# EAGLE design ECAM02-EE2.0 (EAGLE 7.4.0)
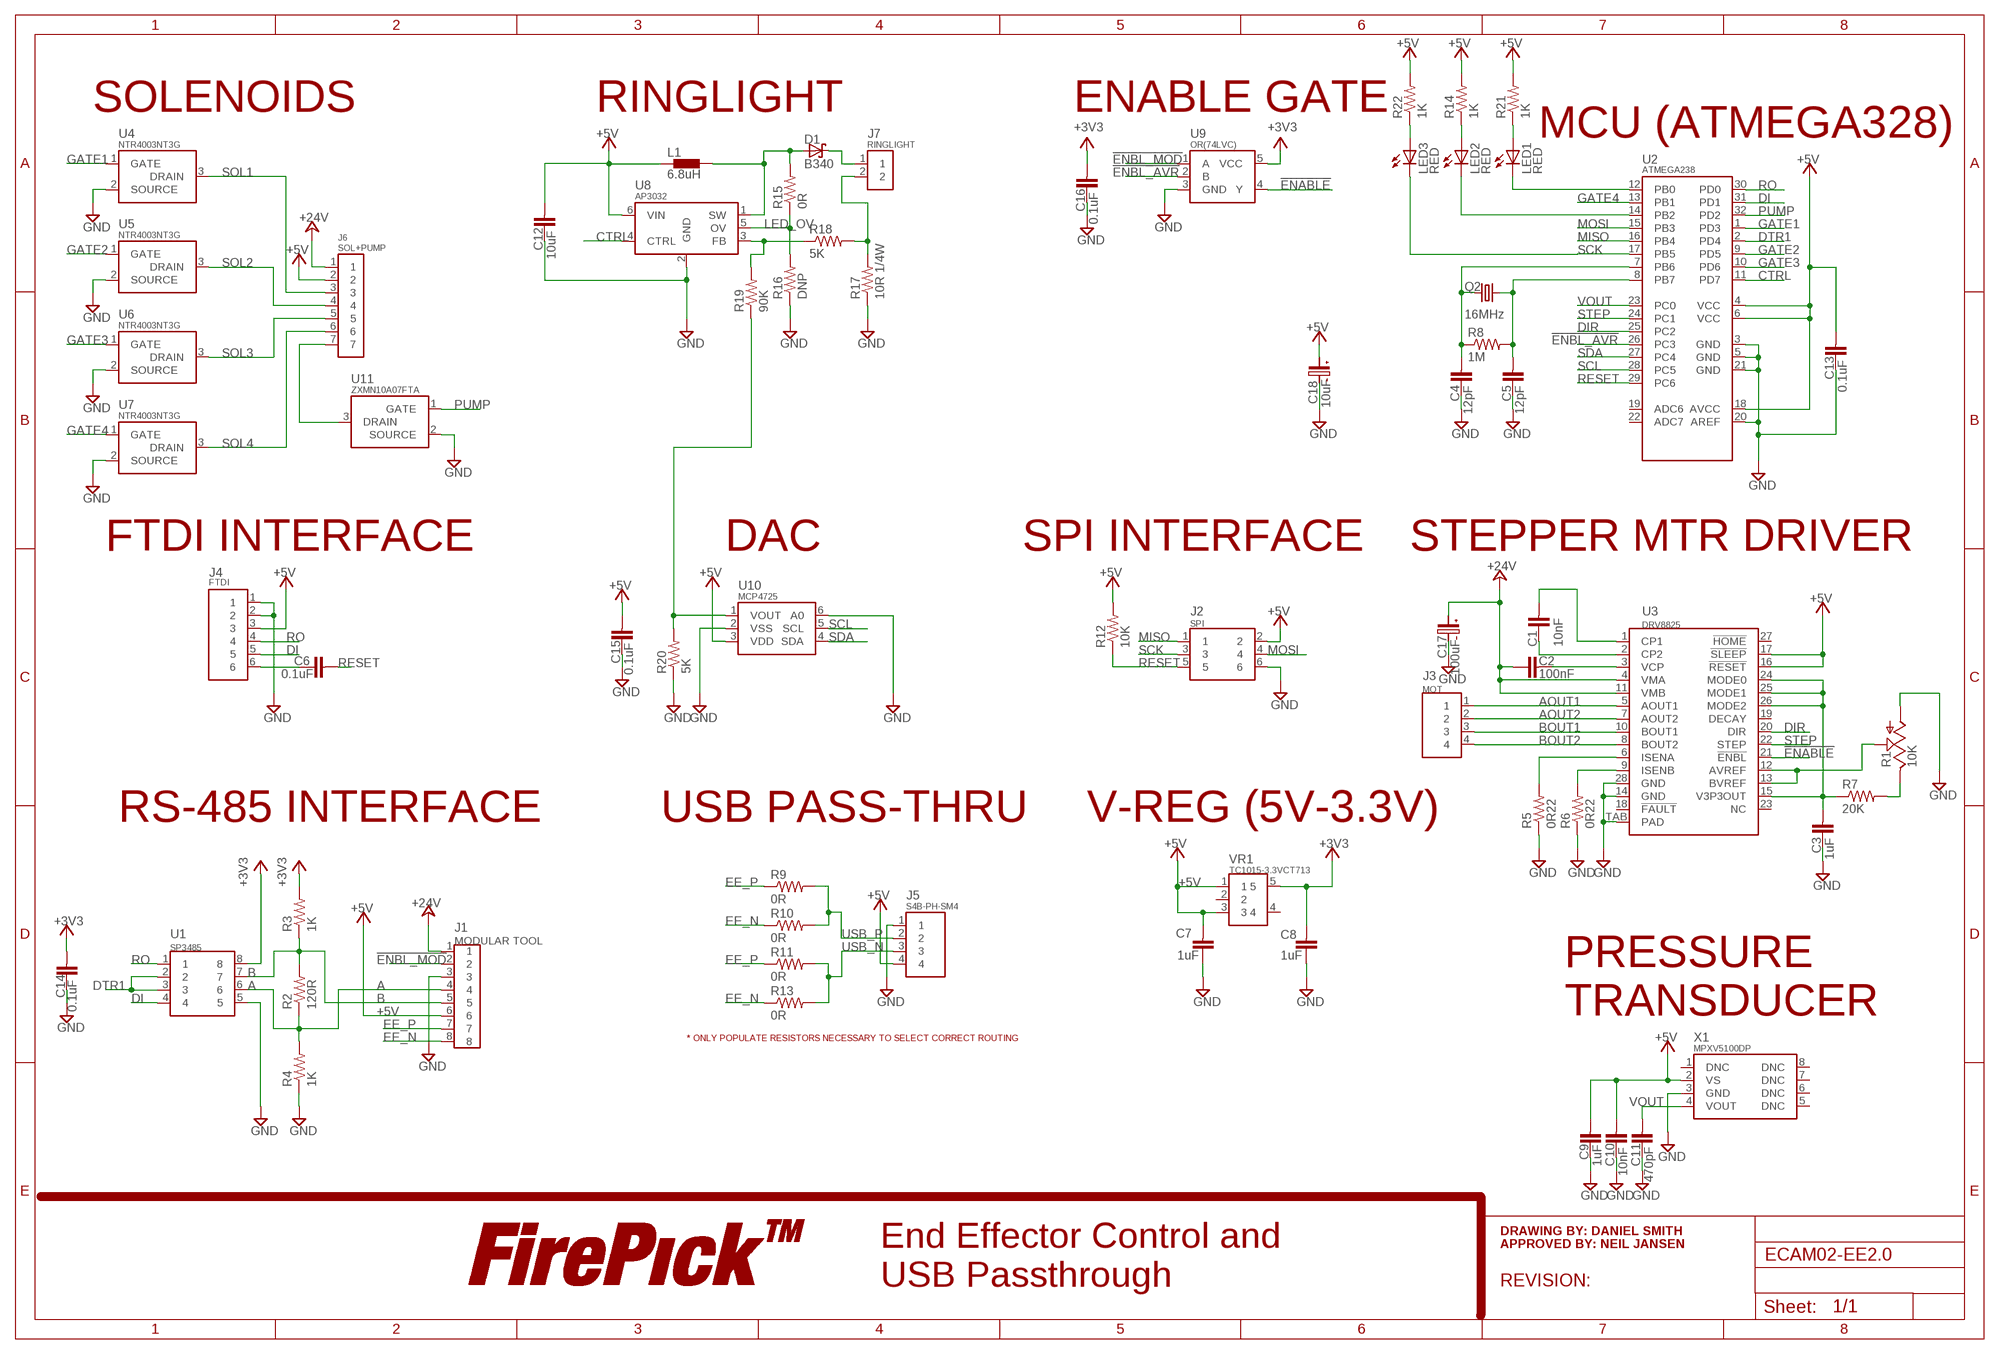
[diagram p0: schematic, sheet 1]

## Parts
C1  10nF  CPL-CAP-X7R-0603-10NF-50V  [C0603]
C2  100nF  CPL-CAP-X7R-0603-100NF-50V  [C0603]
C3  1uF  CPL-CAP-X5R-0603-1UF-50V  [C0603]
C4  12pF  CPL-CAP-C0G-0603-12PF-50V  [C0603]
C5  12pF  CPL-CAP-C0G-0603-12PF-50V  [C0603]
C6  0.1uF  CPL-CAP-X7R-0603-100NF-50V  [C0603]
C7  1uF  CPL-CAP-X5R-0603-1UF-50V  [C0603]
C8  1uF  CPL-CAP-X5R-0603-1UF-50V  [C0603]
C9  1uF  CPL-CAP-X5R-0603-1UF-50V  [C0603]
C10  10nF  CPL-CAP-X7R-0603-10NF-50V  [C0603]
C11  470pF  CPL-CAP-X7R-0603-470PF-100V  [C0603]
C12  10uF  CPL-CAP-X5R-0603-10UF-25V  [C0603]
C13  0.1uF  CPL-CAP-X7R-0603-0.1UF-35V  [C0603]
C14  0.1uF  CPL-CAP-X7R-0603-0.1UF-35V  [C0603]
C15  0.1uF  CPL-CAP-X7R-0603-0.1UF-35V  [C0603]
C16  0.1uF  CPL-CAP-X7R-0603-0.1UF-35V  [C0603]
C17  100uF  CPL-CAP-ALU-SMD-100UF-50V  [C-SMD-6.3MM]
C18  10uF  CPL-CAP-ALU-6.4MM-10UF-10V  [C-SMD-6.3MM]
D1  B340  CPL-DIO-B340-13-F-SMA  [DIO-SMA]
J1  MODULAR TOOL  CPL-CON-JST-2.0MM-8P-SMT-VRT  [CON-JST-PH-2.0MM-8P-SMT-VRT]
J2  SPI  CPL-CON-HEADER-0.1IN-2X3P-M  [CON-HDR-2X3P]
J3  MOT  CPL-CON-JST-2.0MM-4P-M-THRU-VRT  [CON-JST-PH-2.0MM-4P-THRU-VRT]
J4  FTDI  CPL-CON-HEADER-0.1IN-6P-M  [CON-HDR-6POS-MALE]
J5  S4B-PH-SM4  CPL-CON-JST-2.0MM-4P-M-SMT-VRT  [CON-JST-PH-2.0MM-4P-SMT-VRT]
J6  SOL+PUMP  CPL-CON-JST-2.0MM-7P-M-SMT-VRT  [CON-JST-PH-2.0MM-7P-SMT-VRT]
J7  RINGLIGHT  CPL-CON-JST-2.0MM-2P-M-SMT-VRT  [CON-JST-PH-2.0MM-2P-SMT-VRT]
L1  6.8uH  CPL-IND-6.8UH-250MA  [0603]
LED1  RED  CPL-LED-0603-RED  [LED0603]
LED2  RED  CPL-LED-0603-RED  [LED0603]
LED3  RED  CPL-LED-0603-RED  [LED0603]
LOGO2  LOGO-FIREPICKLARGE  [LOGO-FIREPICK]
Q2  16MHz  CPL-OSC-CRY-16MHZ-18PF  [HC-49/U-S]
R1  10K  TC33X-2  [TC33X-2]
R2  120R  CPL-RES-0603-120-0.1W  [R0603]
R3  1K  CPL-RES-0603-1K-0.1W  [R0603]
R4  1K  CPL-RES-0603-1K-0.1W  [R0603]
R5  0R22  CPL-RES-1206-0.22-0.5W  [R1206]
R6  0R22  CPL-RES-1206-0.22-0.5W  [R1206]
R7  20K  CPL-RES-0603-20K-0.1W  [R0603]
R8  1M  CPL-RES-0603-1M-0.1W  [R0603]
R9  0R  CPL-RES-0603-0-0.1W  [R0603]
R10  0R  CPL-RES-0603-0-0.1W  [R0603]
R11  0R  CPL-RES-0603-0-0.1W  [R0603]
R12  10K  CPL-RES-0603-10K-0.1W  [R0603]
R13  0R  CPL-RES-0603-0-0.1W  [R0603]
R14  1K  CPL-RES-0603-1K-0.1W  [R0603]
R15  0R  CPL-RES-0603-0-0.1W  [R0603]
R16  DNP  CPL-RES-0603-0-0.1W  [R0603]
R17  10R 1/4W  CPL-RES-1206-10-0.25W1206  [R1206]
R18  5K  CPL-RES-0603-5K-0.1W  [R0603]
R19  90K  CPL-RES-0603-90K-0.1W  [R0603]
R20  5K  CPL-RES-0603-5K-0.1W  [R0603]
R21  1K  CPL-RES-0603-1K-0.1W  [R0603]
R22  1K  CPL-RES-0603-1K-0.1W  [R0603]
U1  SP3485  [SOICN-8]
U2  ATMEGA238  CPL-MCU-ATMEL-AT328-32TQFP  [32-TQF(ATMEGA)]
U3  DRV8825  CPL-MDR-DRV8825  [28-HSSOP]
U4  NTR4003NT3G  CPL-MOSFET-NCH-SOT23NTR4003N  [SOT-23-3]
U5  NTR4003NT3G  CPL-MOSFET-NCH-SOT23NTR4003N  [SOT-23-3]
U6  NTR4003NT3G  CPL-MOSFET-NCH-SOT23NTR4003N  [SOT-23-3]
U7  NTR4003NT3G  CPL-MOSFET-NCH-SOT23NTR4003N  [SOT-23-3]
U8  AP3032  CPL-LED-DRIVER-WHT-AP3032  [SOT-23-6]
U9  OR(74LVC)  CPL-IC-LOGIC-OR-1CH-74LVC  [SOT-23-5]
U10  MCP4725  CPL-DAC-12BIT-SOT23  [SOT-23-6]
U11  ZXMN10A07FTA  CPL-MOSFET-NCH-SOT23ZXMN10A07FTA  [SOT-23-3]
VR1  TC1015-3.3VCT713  CPL-REG-LIN-3.3V-0.1A  [SOT-23-5]
X1  MPXV5100DP  CPL-SEN-PRS-MPXV5100DP  [8-SMD]

## Nets
!ENABLE: U3.21(!ENBL) U9.4(Y)
!ENBL_AVR: U2.26(PC3) U9.2(B)
!ENBL_MOD: J1.2 U9.1(A)
+3V3: C8.2 C14.2 C16.2 R3.2 U1.8 U9.5(VCC) VR1.5
+5V: C7.2 C9.2 C10.2 C12.2 C13.2 C15.2 C18.POS J1.6 J2.2 J4.3 J5.4 J6.2 L1.1 R12.2 R14.2 R21.2 R22.2 U2.4(VCC) U2.6(VCC) U2.18(AVCC) U3.16(!RESET) U3.17(!SLEEP) U8.6(VIN) U10.3(VDD) VR1.1 VR1.3 X1.2(VS)
+24V: C2.1 C17.POS J1.1 J6.1 U3.4(VMA) U3.11(VMB)
A: J1.4 R2.1 R4.2 U1.6
AOUT1: J3.1 U3.5(AOUT1)
AOUT2: J3.2 U3.7(AOUT2)
B: J1.5 R2.2 R3.1 U1.7
BOUT1: J3.3 U3.10(BOUT1)
BOUT2: J3.4 U3.8(BOUT2)
CTRL: U2.11(PD7) U8.4(CTRL)
DI: J4.5 U1.4 U2.31(PD1)
DIR: U2.25(PC2) U3.20(DIR)
DTR1: U1.2 U1.3 U2.2(PD4)
EE_N: J1.8 R10.1 R13.1
EE_P: J1.7 R9.1 R11.1
GATE1: U2.1(PD3) U4.1(GATE)
GATE2: U2.9(PD5) U5.1(GATE)
GATE3: U2.10(PD6) U6.1(GATE)
GATE4: U2.13(PB1) U7.1(GATE)
GND: C3.1 C4.1 C5.1 C7.1 C8.1 C9.1 C10.1 C11.1 C12.1 C13.1 C14.1 C15.1 C16.1 C17.NEG C18.NEG J1.3 J2.6 J4.1 J4.2 J5.1 R1.1(A) R4.1 R5.1 R6.1 R16.1 R17.1 R20.1 U1.5 U2.3(GND) U2.5(GND) U2.20(AREF) U2.21(GND) U3.14(GND) U3.28(GND) U3.TAB(PAD) U4.2(SOURCE) U5.2(SOURCE) U6.2(SOURCE) U7.2(SOURCE) U8.2(GND) U9.3(GND) U10.2(VSS) U10.6(A0) U11.2(SOURCE) X1.3(GND)
LED_ANODE: D1.NEG(C) J7.1
LED_CATHODE: J7.2 R17.2 R18.2
LED_FB: R18.1 R19.2 U8.3(FB)
LED_OV: R15.1 R16.2 U8.5(OV)
LED_SW: D1.POS(A) L1.2 R15.2 U8.1(SW)
MISO: J2.1 U2.16(PB4)
MOSI: J2.4 U2.15(PB3)
N$1: LED1.A R21.1
N$2: LED2.A R14.1
N$3: LED1.C U2.12(PB0)
N$4: LED2.C U2.14(PB2)
N$5: C1.2 U3.1(CP1)
N$6: C1.1 U3.2(CP2)
N$7: C2.2 U3.3(VCP)
N$8: R5.2 U3.6(ISENA)
N$9: R6.2 U3.9(ISENB)
N$10: R19.1 R20.2 U10.1(VOUT)
N$11: LED3.A R22.1
N$12: J6.7 U11.3(DRAIN)
N$13: C3.2 R7.1 U3.15(V3P3OUT) U3.24(MODE0) U3.25(MODE1) U3.26(MODE2)
N$14: R1.3(E) R7.2
N$15: R1.2(S) U3.12(AVREF) U3.13(BVREF)
N$16: C6.1 J4.6
PUMP: U2.32(PD2) U11.1(GATE)
RESET: C6.2 J2.5 R12.1 U2.29(PC6)
RO: J4.4 U1.1 U2.30(PD0)
SCK: J2.3 LED3.C U2.17(PB5)
SCL: U2.28(PC5) U10.5(SCL)
SDA: U2.27(PC4) U10.4(SDA)
SOL1: J6.3 U4.3(DRAIN)
SOL2: J6.4 U5.3(DRAIN)
SOL3: J6.5 U6.3(DRAIN)
SOL4: J6.6 U7.3(DRAIN)
STEP: U2.24(PC1) U3.22(STEP)
USB_N: J5.3 R11.2 R13.2
USB_P: J5.2 R9.2 R10.2
VOUT: C11.2 U2.23(PC0) X1.4(VOUT)
XTAL1: C4.2 Q2.1 R8.1 U2.7(PB6)
XTAL2: C5.2 Q2.2 R8.2 U2.8(PB7)
Unconnected: U2.19(ADC6) U2.22(ADC7) U3.18(!FAULT) U3.19(DECAY) U3.23(NC) U3.27(!HOME) VR1.2 VR1.4 X1.1(DNC) X1.5(DNC) X1.6(DNC) X1.7(DNC) X1.8(DNC)

## Notes on the sheet
- SOLENOIDS | RINGLIGHT | ENABLE GATE
- MCU (ATMEGA328)
- FTDI INTERFACE | DAC | SPI INTERFACE | STEPPER MTR DRIVER
- SPI
- RS-485 INTERFACE | USB PASS-THRU | V-REG (5V-3.3V)
- PRESSURE 
  TRANSDUCER
- * ONLY POPULATE RESISTORS NECESSARY TO SELECT CORRECT ROUTING
- DRAWING BY: DANIEL SMITH
- APPROVED BY: NEIL JANSEN
- End Effector Control and
  USB Passthrough
- REVISION:

## Library data of the parts
C1 C10 = TinWhiskers:CPL-CAP-X7R-0603-10NF-50V: Capacitor: 10nF (0.01uF), X7R, 5%; Package: 0603; Datasheet:; PARTNO: GRM188R71H103KA01D
C2 C6 = TinWhiskers:CPL-CAP-X7R-0603-100NF-50V: Capacitor: 100nF, 50V, 10%; Package: 0603; PARTNO: UMK107B7104KA-T
C3 C7-C9 = TinWhiskers:CPL-CAP-X5R-0603-1UF-50V: Capacitor: 1uF, 50V, 10%; Package: 0603; Datasheet: http://www.mouser.com/ds/2/396/mlcc_all_e-541559.pdf; PARTNO: UMK107AB7105KA-T
C4 C5 = TinWhiskers:CPL-CAP-C0G-0603-12PF-50V: Capacitor: 12pF, 50V, 5%; Package: 0603; Datasheet: http://download.siliconexpert.com/pdfs/2011/4/6/10/1/57/701/samelm_/manual/cl10c120jb8nnnc.pdf; PARTNO: GRM1885C1H120FA01J
C11 = TinWhiskers:CPL-CAP-X7R-0603-470PF-100V: Capacitor: 470pF, 100V, 5%; Package: 0603 Datasheet: http://www.mouser.com/ds/2/427/vjw1bcbascomseries-223529.pdf; PARTNO: GRM188R72A471KA01D
C12 = TinWhiskers:CPL-CAP-X5R-0603-10UF-25V: Capacitor: 10uF, 16V, 20%, X5R; Package: 0603; Datasheet: http://www.murata.com/~/media/webrenewal/support/library/catalog/products/capacitor/mlcc/c02e.ashx; PARTNO: GRM188R61C106MA73D
C13-C16 = TinWhiskers:CPL-CAP-X7R-0603-0.1UF-35V: Capacitor: 0.1uF, 35V, 10%, X7R; Package: 0603; Datasheet: http://www.yuden.co.jp/productdata/catalog/en/mlcc01_hq_e.pdf; PARTNO: GMK107BJ104KAHT
C17 = TinWhiskers:CPL-CAP-ALU-SMD-100UF-50V: Capacitor: Al-Electrolytic, 100uF, 20%, 50V, 2000hrs@105C; Package: 6.3MM Diameter (Can); Datasheet: http://industrial.panasonic.com/lecs/www-data/pdf/ABA0000/ABA0000CE135.pdf; PARTNO: EMVA500ADA101MHA0G
C18 = TinWhiskers:CPL-CAP-ALU-6.4MM-10UF-10V: Capacitor: Al-Electrolytic, 10uF, 10V 20$; Package: 6.3MM SMT (Can); Datasheet: http://www.ti.com/lit/ds/symlink/lms8117a.pdf; PARTNO: EMVH350ADA100MF60G
D1 = TinWhiskers:CPL-DIO-B340-13-F-SMA: Diode: B340-13-F (Rectifier, Shottky), Vrrm=40V, If=3A Package: SMA Datasheet: http://www.mouser.com/ds/2/115/ds30891-89887.pdf; PARTNO: B340A-13-F
J1 = TinWhiskers:CPL-CON-JST-2.0MM-8P-SMT-VRT: Connector: 2.0MM Pitch, 2-Pin; Package: SMT, Vertical; Datasheet: http://www.jst-mfg.com/product/pdf/eng/ePH.pdf; PARTNO: B8B-PH-SM4-TB(LF)(SN)
J2 = TinWhiskers:CPL-CON-HEADER-0.1IN-2X3P-M: Connector: 0.1" Pitch, 2x3P Datasheet: http://www.mouser.com/ds/2/418/NG_CD_825440_G_baseFilename-672958.pdf; PARTNO: 67996-206HLF
J3 = TinWhiskers:CPL-CON-JST-2.0MM-4P-M-THRU-VRT: Connector: 2.0MM Pitch, 4-Pin (JST: B4B-PH-K-S(LF)(SN)); Package: Thru-Hole, Vertical; Datasheet: http://www.jst-mfg.com/product/pdf/eng/ePH.pdf; PARTNO: B4B-PH-K-S(LF)(SN)
J4 = TinWhiskers:CPL-CON-HEADER-0.1IN-6P-M: Connector: Header, 0.1"-Pitch, 6-Pos, Pins (Male); PARTNO: S6B-PH-SM4-TB(LF)(SN)
J5 = TinWhiskers:CPL-CON-JST-2.0MM-4P-M-SMT-VRT: Connector: 2.0MM Pitch, 2-Pin; Package: SMT, Vertical; Datasheet: http://www.jst-mfg.com/product/pdf/eng/ePH.pdf; PARTNO: S4B-PH-SM4-TB(LF)(SN)
J6 = TinWhiskers:CPL-CON-JST-2.0MM-7P-M-SMT-VRT: Connector: 2.0MM Pitch, 7-Pin, (JST: B7B-PH-SM4-TB(LF)(SN)); Package: SMT, Vertical' Datasheet: http://www.jst-mfg.com/product/detail_e.php?series=199; PARTNO: B7B-PH-SM4-TB(LF)(SN)
J7 = TinWhiskers:CPL-CON-JST-2.0MM-2P-M-SMT-VRT: Connector: 2.0MM Pitch, 2-Pin; Package: SMT, Vertical; Datasheet: http://www.jst-mfg.com/product/pdf/eng/ePH.pdf; PARTNO: B2B-PH-SM4-TB(LF)(SN)
L1 = TinWhiskers:CPL-IND-6.8UH-250MA: Inductor: 6.8uH, 20%, 250mA; Packages: 0603; Datasheet: http://ds.yuden.co.jp/TYCOMPAS/ut/detail.do?productNo=BRL1608T6R8M&fileName=BRL1608T6R8M_SS&mode=specSheetDownload; PARTNO: BRL1608T6R8M
LED1-LED3 = TinWhiskers:CPL-LED-0603-RED: LED: Red; Package: 0603
LOGO2 = FirePick:LOGO-FIREPICK; BOM: EXCLUDE; DNP: T
Q2 = TinWhiskers:CPL-OSC-CRY-16MHZ-18PF: Crystal Oscillator: 16MHz, 18pF, 50 Ohm (ESR); Package: HC-49/US; Datasheet: http://cfm.citizen.co.jp/english/product/pdf/HCM49.pdf; PARTNO: HCM4916000000ABJT
R1 = TinWhiskers:TC33X-2: Potentiometer, Trim: 10 kOhm, 25%; Package: SMT (3-Pin); Datasheet: http://www.mouser.com/ds/2/54/TC33-75480.pdf; PARTNO: TC33X-2-103E
R2 = TinWhiskers:CPL-RES-0603-120-0.1W: Resistor: 120 Ohm, 0.1W, 1%; Package: 0603 (SMT); Datasheet:; PARTNO: RC0603FR-07120RL
R3 R4 = TinWhiskers:CPL-RES-0603-1K-0.1W: Resistor: 1 kOhm, 0.1W, 1%; Package: 0603; Datasheet: http://www.yageo.com/NewPortal/yageodocoutput?fileName=/pdf/R-Chip/PYu-RC_Group_51_RoHS_L_3.pdf; PARTNO: RC0603FR-071KL
R5 R6 = TinWhiskers:CPL-RES-1206-0.22-0.5W: Resistor: 0.22 Ohm, 0.5W, 1%, 100 ppm/C Package: 1206 Datasheet: http://www.mouser.com/ds/2/427/rcwe-244377.pdf; PARTNO: RL1206FR-7W0R22L
R7 = TinWhiskers:CPL-RES-0603-20K-0.1W: Resistor: 20 kOhms, 0.1W, 5%, X7R; Package: 0603;; PARTNO: RC0603FR-0722KL
R8 = TinWhiskers:CPL-RES-0603-1M-0.1W: Resistor: 1MOhm, 0.1W, 5%; Package: 0603; Datasheet: http://www.samsungsem.com/global/support/library/product-catalog/__icsFiles/afieldfile/2015/01/12/CHIP_RESISTOR_150112_1.pdf; PARTNO: RC0603FR-071ML
R9-R11 R13 R15 R16 = TinWhiskers:CPL-RES-0603-0-0.1W: Resistor: 0 Ohm, 0.1W, 5%; Specs: http://www.mouser.com/ds/2/315/AOA0000CE1-37422.pdf; PARTNO: RC0603JR-070RL
R12 = TinWhiskers:CPL-RES-0603-10K-0.1W: Resistor: 10kOhm, 0.1W, 1%; Package: 0603; Datasheet: http://www.mouser.com/ds/2/315/AOA0000CE2-37512.pdf; PARTNO: RC0603FR-0710KL
R14 R21 R22 = TinWhiskers:CPL-RES-0603-1K-0.1W: Resistor: 1 kOhm, 0.1W, 1%; Package: 0603; Datasheet: http://www.yageo.com/NewPortal/yageodocoutput?fileName=/pdf/R-Chip/PYu-RC_Group_51_RoHS_L_3.pdf
R17 = TinWhiskers:CPL-RES-1206-10-0.25W; PARTNO: RC1206FR-0710RL
R18 R20 = TinWhiskers:CPL-RES-0603-5K-0.1W: Resistor: 5.0 kOhm, 0.15W, 0.1%; Package: 0603; Datasheet: http://www.vishay.com/docs/60057/pnm.pdf; PARTNO: PNM0603E5001BST5
R19 = TinWhiskers:CPL-RES-0603-90K-0.1W: Resistor: 90.9 kOhm, 0.1W, 1%; Package: 0603; Datasheet: http://www.yageo.com/NewPortal/yageodocoutput?fileName=/pdf/R-Chip/PYu-RC_Group_51_RoHS_L_3.pdf; PARTNO: RC0603FR-0790K9L
U1 = TinWhiskers:SP3485: Transceiver: RS-485 Chip; Package: SOICN-8; Datasheet: http://www.exar.com/common/content/document.ashx?id=639; PARTNO: SP3485
U2 = TinWhiskers:CPL-MCU-ATMEL-AT328-32TQFP: Processor: Atmega AT328; Package: 32-TQFP; Datasheet: http://www.atmel.com/devices/atmega328.aspx; PARTNO: ATMEGA328-AUR
U3 = TinWhiskers:CPL-MDR-DRV8825: Motor Driver: DRV8825 (Texas Instrument); Package: (SMT) 28-HSSOP; Datasheet: http://www.ti.com/lit/ds/symlink/drv8825.pdf; PARTNO: DRV8825PWPR
U4-U7 = TinWhiskers:CPL-MOSFET-NCH-SOT23: MOSFET: N-Channel, Switching; Package: SOT23; Datasheet: http://www.onsemi.com/pub_link/Collateral/NTR4003N-D.PDF; PARTNO: NTR4003NT3G
U8 = TinWhiskers:CPL-LED-DRIVER-WHT-AP3032: LED Driver: White, Step-Up, AP3032 (Diodes, Inc.); Package: SOT23-6; Datasheet: http://www.diodes.com/_files/datasheets/AP3032.pdf; PARTNO: AP3032KTR-G1
U9 = TinWhiskers:CPL-IC-LOGIC-OR-1CH-74LVC: Logic Gate: OR, 1-Channel; Package: SOT23-5; Datasheet: http://www.ti.com/lit/ds/symlink/sn74lvc1g32.pdf; PARTNO: SN74LVC1G32DBVR
U10 = TinWhiskers:CPL-DAC-12BIT-SOT23: Digital-Analog Converter: 12-Bit, MPC4725; Package: SOT23-6; Datasheet: http://ww1.microchip.com/downloads/en/DeviceDoc/22039d.pdf; PARTNO: MCP4725A0T-E/CH
U11 = TinWhiskers:CPL-MOSFET-NCH-SOT23: MOSFET: N-Channel, Switching; Package: SOT23; Datasheet: http://www.onsemi.com/pub_link/Collateral/NTR4003N-D.PDF; PARTNO: ZXMN10A07FTA
VR1 = TinWhiskers:CPL-REG-LIN-3.3V-0.1A: Voltage Regulator: Linear, Vmax=6, Vout=3.3V, Io=0.1mA; Package: SOT-23-5 Datasheet: http://www.mouser.com/ds/2/268/21335b-29125.pdf; PARTNO: TC1015-3.3VCT713
X1 = TinWhiskers:CPL-SEN-PRS-MPXV5100DP: Pressure Sensor: MPXV5100DP, Temp-Calibrated, Silicon, 5V; Package: SMD-6; Datasheet: http://www.freescale.com/files/sensors/doc/data_sheet/MPX5100.pdf; PARTNO: MPXV5100DP

## Board
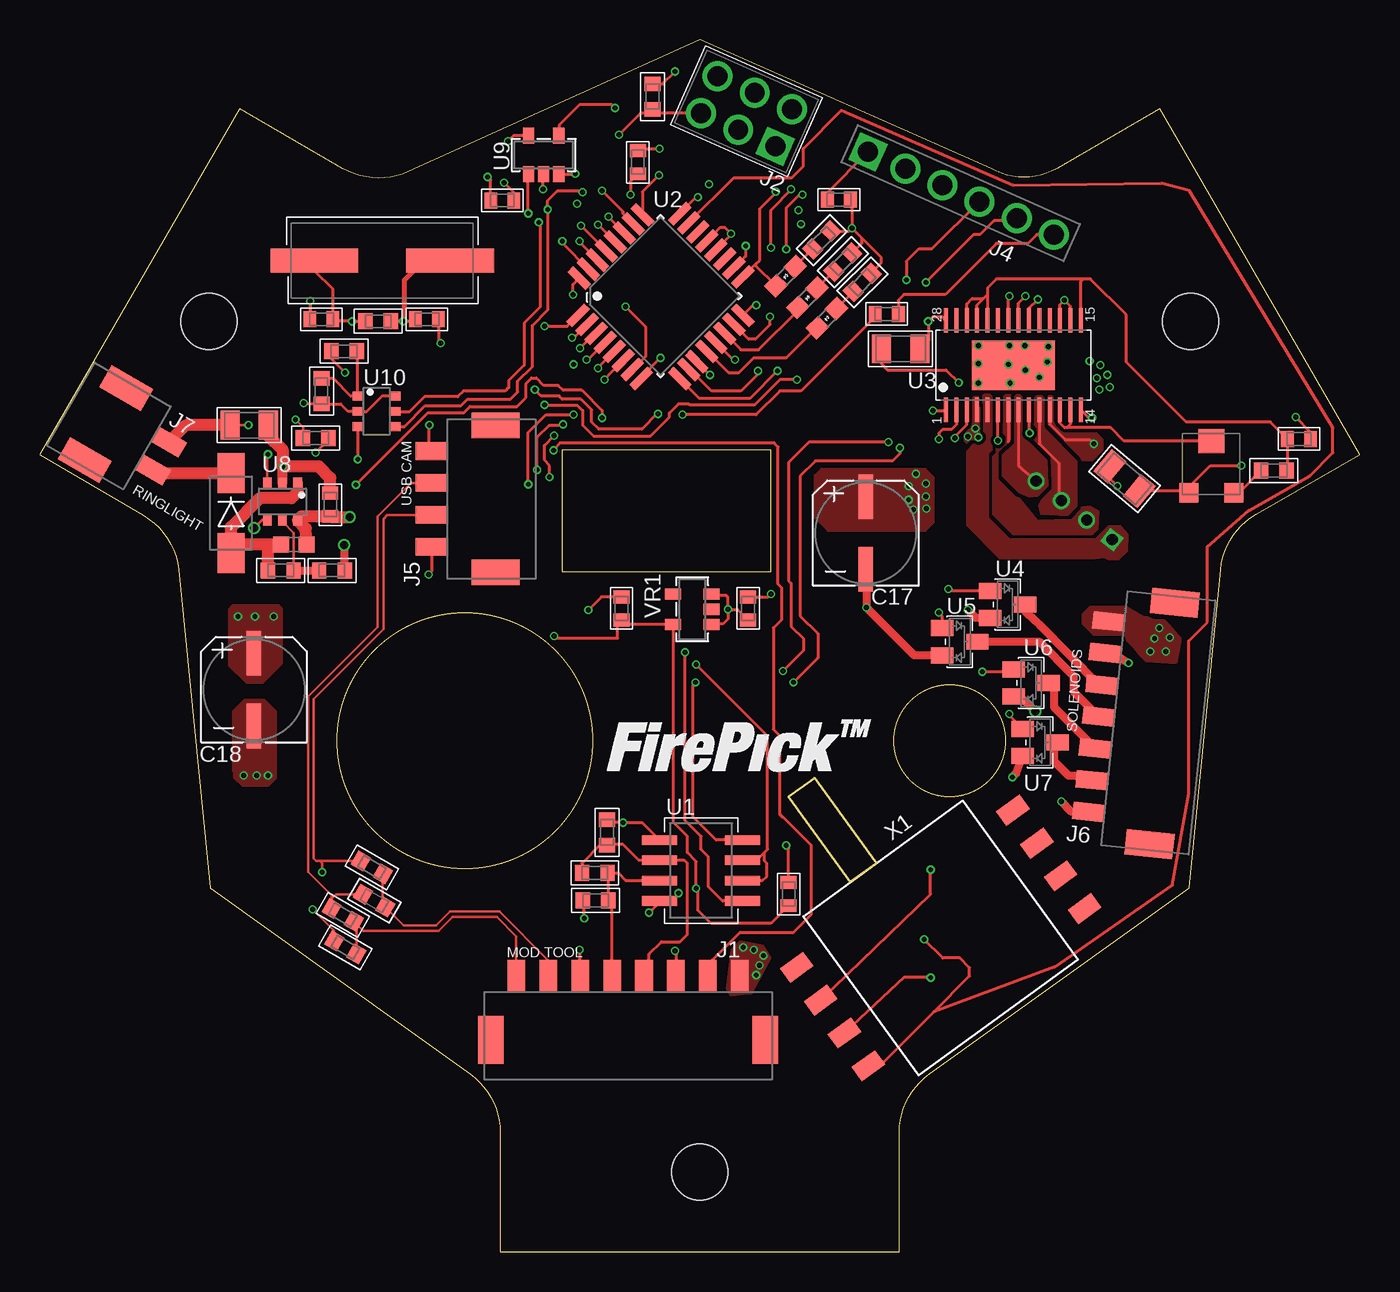
[diagram p1: board, top side]
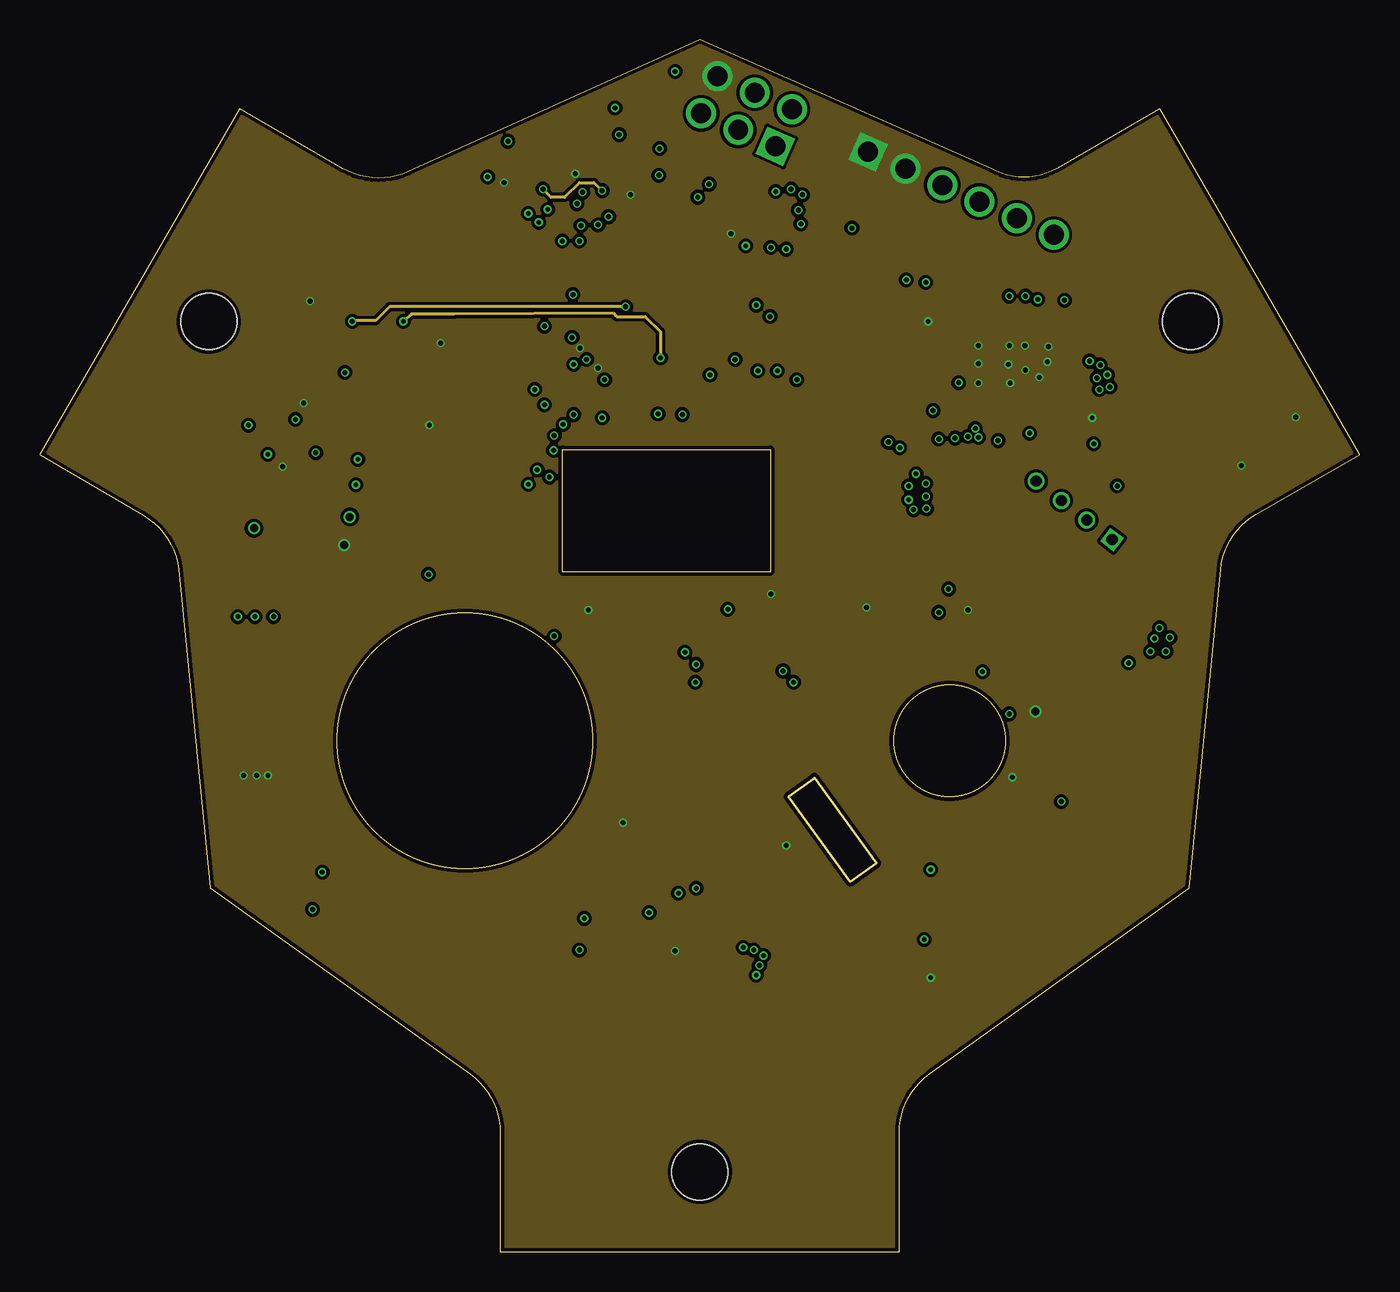
[diagram p2: board, inner layer Route2]
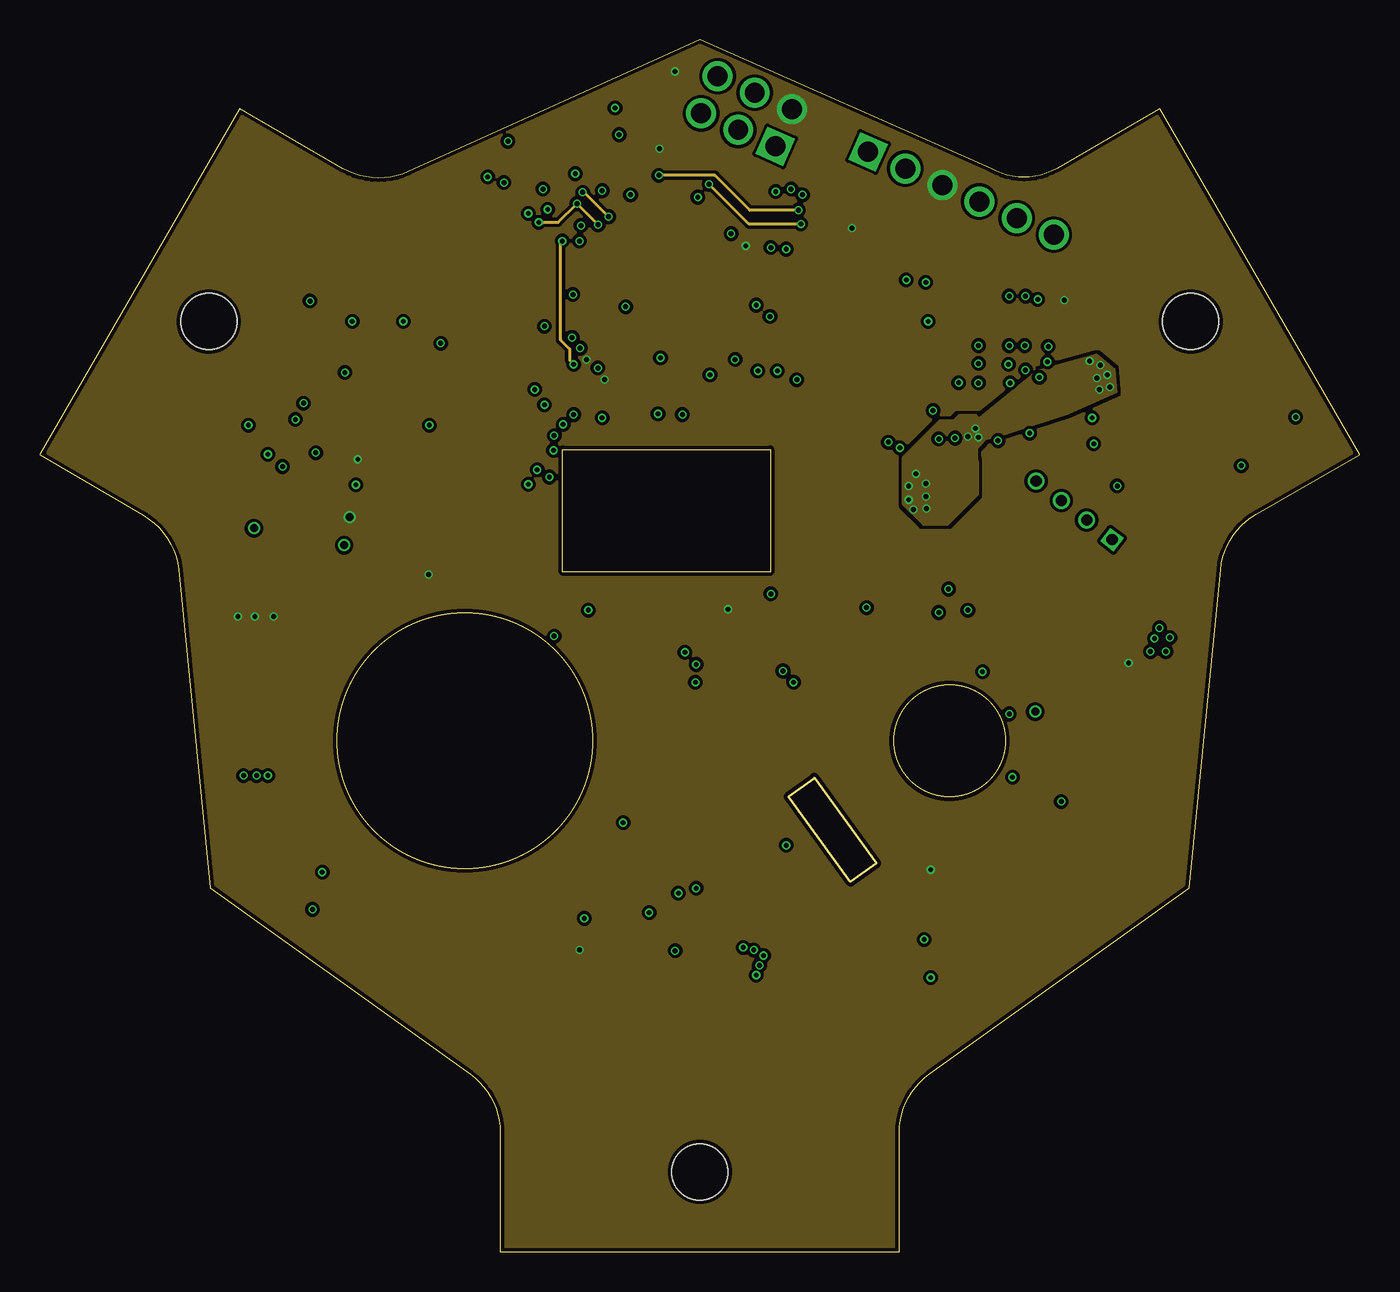
[diagram p3: board, inner layer Route15]
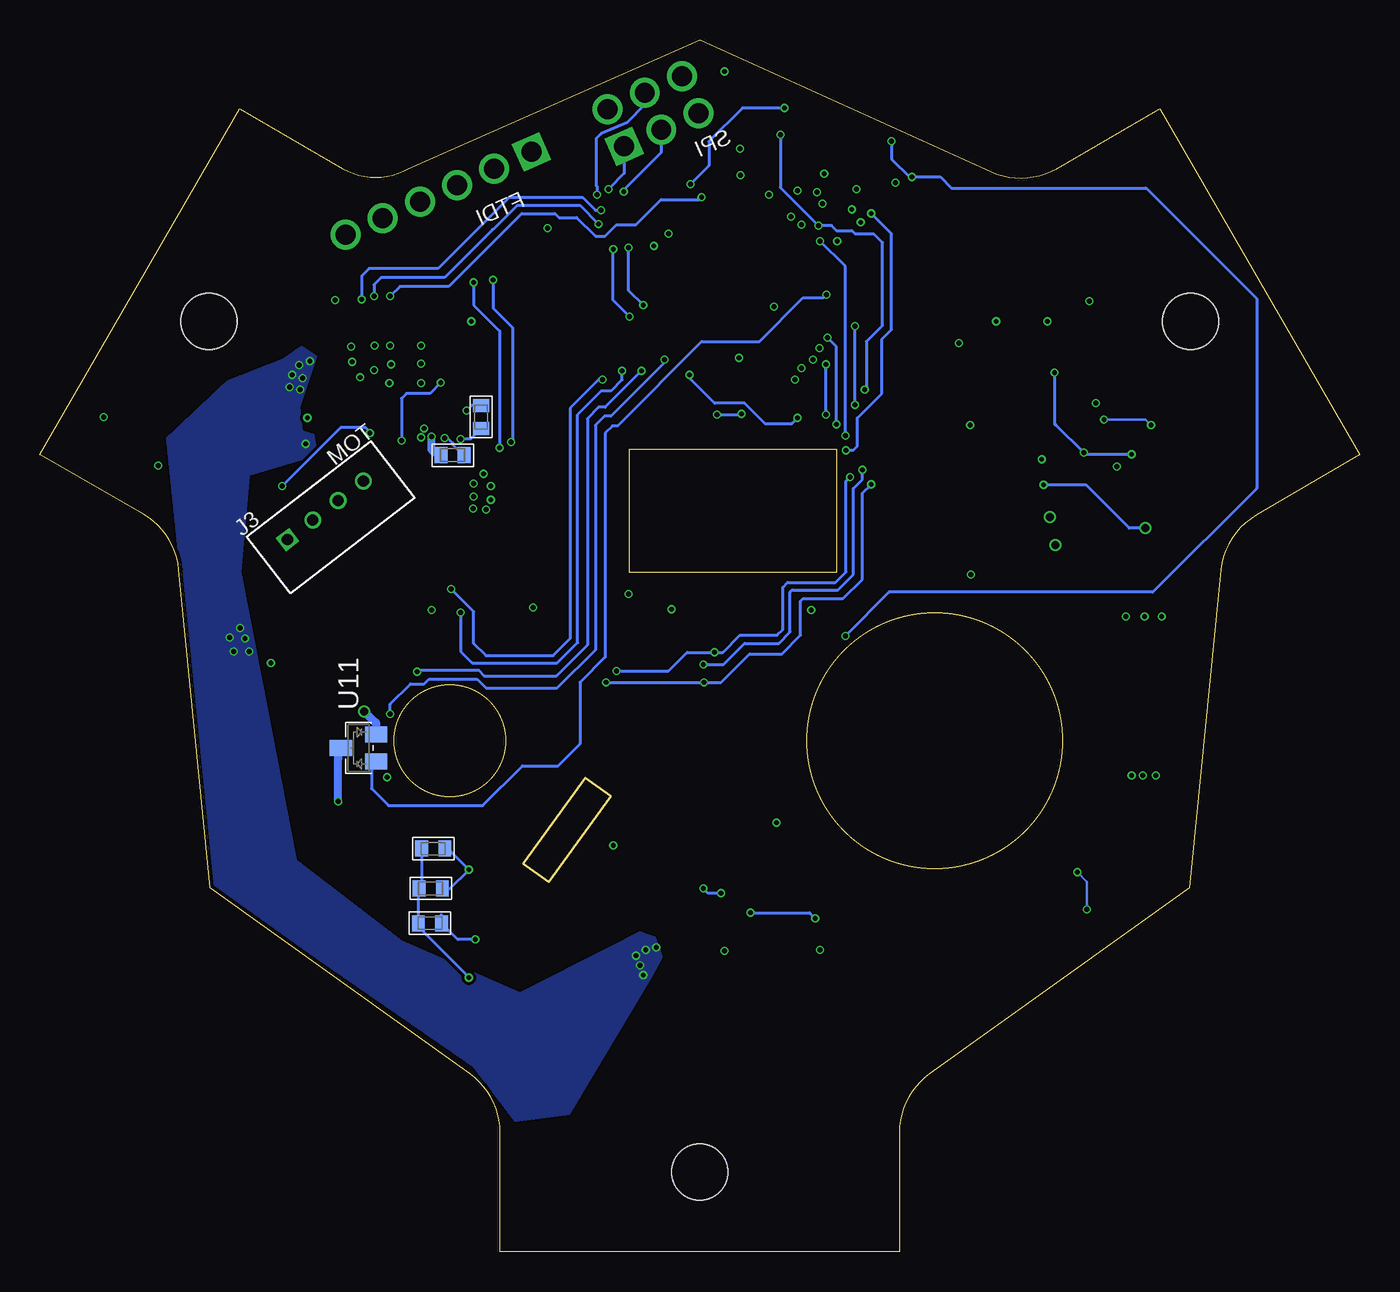
[diagram p4: board, bottom side, seen from below]

Size 82.64 x 75.89 mm. Coordinates in mm from the lower left corner, seen from the top.
Outline: 28.82,0 53.82,0 53.82,7.47 arc-54 55.7,11.13 71.97,22.8 73.94,42.73 arc-54 76.17,46.19 82.64,49.92 70.14,71.58 63.67,67.84 arc-60 59.57,67.84 41.32,75.89 23.07,67.64 arc-54 18.97,67.84 12.5,71.58 0,49.92 6.47,46.12 arc-52 8.7,42.73 10.67,22.8 26.94,11.13 arc-54 28.82,7.47 28.82,0
Outline: 32.74,42.58 32.74,50.24 45.74,50.24 45.74,42.58 32.74,42.58
Outline: circle at 56.96,32 radius 3.5
Outline: circle at 26.6,32 radius 8
Copper layers (1*2*15*16): Top 0.035mm / dielectric 0.2mm / Route2 0.0175mm / dielectric 0.3mm / Route15 0.0175mm / dielectric 0.2mm / Bottom 0.035mm
Design rules "HQPCB_4layer_DRU_no_angle": minimum track width 6mil, minimum drill 12mil, track to track 8mil, track to pad 8mil, pad to pad 6mil, via to via 8mil, smd to smd 0mil, copper to edge 10mil, drill to drill 8mil, minimum pad ring 6mil, minimum via ring 4mil, stop-mask expansion 2mil, vias tented up to drill 100mil, thermal gap 10mil
Holes 3.5 mm at 10.58,58.25 72.07,58.25 41.32,5
tRestrict: area 18.6,24 to 34.6,40; area 38.3,2 to 44.3,8; area 69.1,55.2 to 75.1,61.2; area 7.6,55.2 to 13.6,61.2
bRestrict: area 38.3,2 to 44.3,8; area 69.1,55.2 to 75.1,61.2; area 7.6,55.2 to 13.6,61.2

### Footprints (pad centres in the part's own frame; a part is rotated, then mirrored left to right if it is on the bottom)
C0603 = smd 0.8 x 1: 1 -0.725,0; 2 0.725,0
C-SMD-6.3MM = smd 0.9 x 2.8: NEG 0,-2.275; POS 0,2.275
DIO-SMA = smd 2.505 x 1.7: NEG 2.5,0; POS -2.5,0
CON-JST-PH-2.0MM-8P-SMT-VRT = smd 1.1 x 2: 1 -7,0; 2 -5,0; 3 -3,0; 4 -1,0; 5 1,0; 6 3,0; 7 5,0; 8 7,0 | smd 1.6 x 3: NC1 -8.6,4; NC2 8.6,4
CON-HDR-2X3P = drill 1.25 square: 1 -2.54,1.27 | drill 1.25: 2 -2.54,-1.27; 3 0,1.27; 4 0,-1.27; 5 2.54,1.27; 6 2.54,-1.27
CON-JST-PH-2.0MM-4P-THRU-VRT = drill 0.7 square: 1 -3,0 | drill 0.7: 2 -1,0; 3 1,0; 4 3,0
CON-HDR-6POS-MALE = drill 1.25 square: 1 -6.35,0 | drill 1.25: 2 -3.8,0; 3 -1.26,0; 4 1.28,0; 5 3.85,0; 6 6.39,0
CON-JST-PH-2.0MM-4P-SMT-VRT = smd 1.1 x 2: 1 -3,0; 2 -1,0; 3 1,0; 4 3,0 | smd 1.6 x 3: NC1 -4.6,4; NC2 4.6,4
CON-JST-PH-2.0MM-7P-SMT-VRT = smd 1.1 x 2: 1 -6,0.1; 2 -4,0.1; 3 -2,0.1; 4 0,0.1; 5 2,0.1; 6 4,0.1; 7 6,0.1 | smd 1.6 x 3: NC1 -7.6,4.1; NC2 7.6,4.1
CON-JST-PH-2.0MM-2P-SMT-VRT = smd 1.1 x 2: 1 -1,0; 2 1,0 | smd 1.6 x 3: NC1 -2.6,4; NC2 2.6,4
0603 = smd 1 x 1: 1 -0.8,0; 2 0.8,0
LED0603 = smd 1.1 x 1: A -0.85,0; C 0.85,0
HC-49/U-S = smd 5.5 x 1.5: 1 -4.25,0; 2 4.25,0
TC33X-2 = smd 1.2 x 1.2: 1 -1.4,-1.8; 3 1.4,-1.8 | smd 1.6 x 1.5: 2 0,1.45
R0603 = smd 0.9 x 1: 1 -0.8,0; 2 0.8,0
R1206 = smd 1.2 x 1.8: 1 -1.2,0; 2 1.2,0
SOICN-8 = smd 2.2 x 0.6: 1 -2.6,1.905; 2 -2.6,0.635; 3 -2.6,-0.635; 4 -2.6,-1.905; 5 2.6,-1.905; 6 2.6,-0.635; 7 2.6,0.635; 8 2.6,1.905
32-TQF(ATMEGA) = smd 1.6 x 0.5: 1 -4.5,2.8; 2 -4.5,2; 3 -4.5,1.2; 4 -4.5,0.4; 5 -4.5,-0.4; 6 -4.5,-1.2; 7 -4.5,-2; 8 -4.5,-2.8; 17 4.5,-2.8; 18 4.5,-2; 19 4.5,-1.2; 20 4.5,-0.4; 21 4.5,0.4; 22 4.5,1.2; 23 4.5,2; 24 4.5,2.8 | smd 0.5 x 1.6: 9 -2.8,-4.5; 10 -2,-4.5; 11 -1.3,-4.5; 12 -0.4,-4.5; 13 0.4,-4.5; 14 1.2,-4.5; 15 2,-4.5; 16 2.8,-4.5; 25 2.8,4.4; 26 2,4.4; 27 1.2,4.4; 28 0.4,4.4; 29 -0.4,4.4; 30 -1.2,4.4; 31 -2,4.4; 32 -2.8,4.4
28-HSSOP = smd 1.55 x 0.25: 1 -2.8,4.225; 2 -2.8,3.575; 3 -2.8,2.925; 4 -2.8,2.275; 5 -2.8,1.625; 6 -2.8,0.975; 7 -2.8,0.325; 8 -2.8,-0.325; 9 -2.8,-0.975; 10 -2.8,-1.625; 11 -2.8,-2.275; 12 -2.8,-2.925; 13 -2.8,-3.575; 14 -2.8,-4.225; 15 2.8,-4.225; 16 2.8,-3.575; 17 2.8,-2.925; 18 2.8,-2.275; 19 2.8,-1.625; 20 2.8,-0.975; 21 2.8,-0.325; 22 2.8,0.325; 23 2.8,0.975; 24 2.8,1.625; 25 2.8,2.275; 26 2.8,2.925; 27 2.8,3.575; 28 2.8,4.225 | smd 3.1 x 5.18: TAB 0,0
SOT-23-3 = smd 1 x 1.4: 1 -0.85,-1.1; 2 0.85,-1.1; 3 0,1.1
SOT-23-6 = smd 0.55 x 0.65: 1 0.95,1.175; 2 0,1.175; 3 -0.95,1.175; 4 -0.95,-1.175; 5 0,-1.175; 6 0.95,-1.175
SOT-23-5 = smd 0.7 x 1: 1 0.95,1.2; 2 0,1.2; 3 -0.95,1.2; 4 -0.95,-1.2; 5 0.95,-1.2
8-SMD = smd 1.8 x 1.115: 1 -8.367,3.81; 2 -8.367,1.27; 3 -8.367,-1.27; 4 -8.367,-3.81; 5 8.367,-3.81; 6 8.367,-1.27; 7 8.367,1.27; 8 8.367,3.81

### Placement (x,y rotation side)
C1  55.02,52.27 90 bottom
C2  56.79,49.89 0 bottom
C3  78.84,50.9 180 top
C4  17.63,58.39 0 top
C5  24.23,58.39 180 top
C6  53.04,58.72 180 top
C7  44.35,40.28 270 top
C8  36.42,40.28 270 top
C9  58.01,25.25 0 bottom
C10  58.17,22.76 0 bottom
C11  58.22,20.57 0 bottom
C12  18.19,46.79 270 top
C13  50.04,65.89 0 top
C14  46.89,22.4 270 top
C15  37.44,68.22 90 top
C16  28.96,65.84 180 top
C17  51.71,45.01 0 top
C18  13.41,35.2 0 top
D1  11.97,46.25 90 top
J1  36.83,17.27 180 top
J2  44.25,71.42 156 top
J3  64.76,46.43 37.6 bottom
J4  57.66,66.29 336 top
J5  24.53,47.14 270 top
J6  66.2,33.52 264 top
J7  7.57,49.83 60 top
L1  15.9,44.3 180 top
LED1  49.28,58.46 225 top
LED2  48.06,59.75 225 top
LED3  46.7,61.09 225 top
LOGO2  35.31,28.35 0 top
Q2  21.44,62.08 0 top
R1  73.36,49.33 0 top
R2  34.75,23.72 0 top
R3  34.8,22 180 top
R4  35.51,26.26 270 top
R5  53.9,56.54 180 top
R6  67.92,48.41 140 top
R7  77.27,48.92 180 top
R8  21.18,58.27 0 top
R9  20.93,21.99 150 top
R10  18.96,21.09 150 top
R11  20.78,24.07 150 top
R12  38.35,72.34 90 top
R13  19.13,19.06 150 top
R14  50.29,61.97 45 top
R15  15.09,42.67 180 top
R16  18.29,42.67 180 top
R17  13.11,51.77 180 top
R18  17.27,50.95 180 top
R19  19.05,56.39 180 top
R20  17.63,53.9 90 top
R21  51.5,60.71 45 top
R22  48.96,63.36 45 top
U1  41.4,23.88 180 top
U2  38.86,59.84 45 top
U3  60.96,55.52 90 top
U4  60.6,40.54 270 top
U5  57.61,38.2 270 top
U6  62.08,35.61 270 top
U7  62.64,31.9 270 top
U8  15.19,46.99 0 top
U9  31.55,68.68 180 top
U10  21.08,52.63 90 top
U11  62.69,31.55 90 bottom
VR1  40.84,40.23 270 top
X1  56.41,19.65 36 top

### Tracks (layer width: path | path; a pad name or v marks a point on that pad's centre or on a via)
!ENABLE  (via drill 0.3)
  Top 0.203: U3.21 61.28,59.41 v61.72,59.84 | U9.4 32.51,69.9 32.51,70.56 33.78,71.83 35.81,71.83 v36.02,71.63
  Route15 0.203: v47.65,64.36 44.4,64.36 v41.91,66.85
  Bottom 0.203: v47.65,64.36 48.82,65.53 52.73,65.53 54.25,64.01 54.3,64.01 57.3,61.01 61.27,61.01 61.72,60.55 v61.72,59.84 | v36.02,71.63 38.66,71.63 40.74,69.55 40.74,68.02 v41.91,66.85
!ENBL_AVR  (via drill 0.3)
  Top 0.203: 37.16,64.38 U2.26 36.52,65.02 36.52,65.13 v35.2,66.45 | v31.5,66.55 31.5,67.43 U9.2
  Route2 0.203: v31.5,66.55 32,66.04 32.87,66.04 33.78,66.95 34.7,66.95 v35.2,66.45
!ENBL_MOD  (via drill 0.3)
  Top 0.203: J1.2 41.83,18 43.84,20.02 47.19,20.02 48.31,21.13 48.31,25.45 46.53,27.23 46.48,27.23 46.33,27.38 46.33,32.31 45.92,32.72 45.92,39.06 46.43,39.57 46.43,41.6 46.23,41.81 46.23,50.39 45.97,50.65 32.56,50.65 v32.16,50.19 | v30.58,65.02 30.58,67.47 U9.1
  Bottom 0.203: v32.16,50.19 31.7,50.19 31.45,50.44 31.45,52.22 29.92,53.75 29.92,57.15 29.31,57.76 29.31,63.75 v30.58,65.02
+3V3  (via drill 0.3)
  Top 0.203: v38.15,21.23 38.8,21.89 U1.8 39.5,21.97 v39.98,22.45 | v34.09,20.88 34.09,21.91 R3.2 | U9.5 29.65,69.88 v29.31,69.55 | v32.21,38.56 32.36,38.41 36.18,38.41 36.18,39.32 C8.2 36.7,39.28 VR1.5 39.67,39.25 39.67,26.87 40.54,26.01 40.54,24.99 41.1,24.43 v41.1,22.76 41.2,22.66 41.2,21.39 42.01,20.57 45.78,20.57 C14.2 | C16.2 28.23,67.12 v28.04,67.31
  Bottom 0.203: v38.15,21.23 34.44,21.23 v34.09,20.88 | v39.98,22.45 40.79,22.45 v41.1,22.76 | v29.31,69.55 29.31,68.43 28.19,67.31 v28.04,67.31 26.26,67.31 25.55,66.6 13.41,66.6 13.39,66.62 6.45,59.69 6.45,47.8 12.95,41.3 29.46,41.3 v32.21,38.56
+5V  (via drill 0.3, 0.5)
  Top 0.203: v33.78,18.9 33.78,17.32 J1.6 | U3.16 64.53,59.21 v64.16,59.59 63.88,59.31 U3.17 | v43.08,40.23 43.67,40.23 C7.2 | v43.08,40.23 43.08,39.62 42.77,39.32 42.08,39.32 VR1.1 | v43.08,40.23 43.08,41 42.98,41.1 42.13,41.1 VR1.3 | R12.2 39,73.14 v39.78,73.91 | v44.2,62.99 44.2,62.35 U2.18 | U2.6 35.36,54.64 v35.36,54.61 | U2.4 34.33,55.88 v34.24,55.88 | X1.2 55.78,22.39 v55.78,23.93 | J5.4 24.53,42.61 v24.33,42.42 | C15.2 37.58,69.09 v38.81,69.09 | C13.2 50.85,65.34 v50.85,64.11 | U10.3 v19.91,49.62 | v50.85,64.11 51.49,63.48 | 51.49,63.48 52.68,62.28 52.68,61.92 52.07,61.31 R21.2 | R14.2 51.49,63.17 51.49,63.48 | R22.2 50.66,63.92 v50.85,64.11
  Top 0.5: J6.2 67.38,37.39 v68.17,36.88 | C12.2 18.27,46.02
  Top 0.762: 18.27,46.02 v19.41,46.02 | C12.2 16.39,46.06 U8.6 16.65,45.3 L1.1
  Bottom 0.203: C10.2 56.95,22.76 v55.78,23.93 57.1,25.25 C9.2
  other vias: 12.4,39.78 13.46,39.78 14.63,39.78
  pour Route15 (rank 2, no thermals): -0.05,49.94 12.5,71.58 41.3,75.95 70.15,71.58 82.65,49.94 71.93,22.76 53.85,-0.05 28.85,0 10.67,22.76
  pour Top (no thermals): 11.79,40.18 11.79,36.73 12.9,35.61 13.97,35.61 15.19,36.83 15.19,40.28 14.99,40.49 12.04,40.49 11.79,40.23
+24V  (via drill 0.3)
  Top 0.203: J1.1 43.83,17.72 | 58.67,52.71 U3.4 | U3.11 63.23,51.83 64.21,50.85 65.73,50.85 v65.99,50.6
  Bottom 0.508: 57.52,50.05 57.93,50.05 58.12,50.24 v58.12,51.05
  Bottom 0.61: C2.1 57.52,50.05
  other vias: 44.7,18.9 66.4,55.52 44.04,19.05 45.06,17.93 66.19,54.71 65.74,55.78 70.1,39.07 69.8,38.4 69.55,37.59 54.86,48.72 55.47,48.11 54.41,47.96 70.76,38.46 70.51,37.59 66.85,54.91 67.01,54.15 66.34,54 44.86,17.32 45.31,18.54 58.78,51 58.57,51.56 54.41,47.09 55.47,47.29 55.52,46.53 54.71,46.48
  pour Route15 (no thermals): 57.71,51.1 58.01,50.6 59.84,50.95 64.36,52.43 67.46,53.8 67.36,55.27 66.19,56.24 62.43,55.22 58.32,51.87
  pour Bottom (no thermals): 66.24,56.74 65.28,56.08 66.34,52.88 66.19,51.41 65.48,51.21 65.28,50.14 66.04,49.63 69.49,48.62 70.05,42.57 68.28,33.53 66.55,24.54 59.99,19.51 52.58,16.26 45.06,20.07 44.09,19.71 43.64,18.44 44.3,17.22 49.48,8.59 52.88,8.13 55.52,11.58 71.83,22.86 74.73,50.95 70.92,54.56 67.41,55.93
  pour Top (no thermals): 43.84,19.51 45.31,19.2 45.82,18.39 44.6,16.15 43.23,16 42.98,16.46 43.28,18.95
  pour Top (rank 3, no thermals): 62.99,52.68 63.09,53.54 63.2,53.64 63.35,53.64 63.45,53.54 63.45,52.02 64.01,51.46 66.04,51.46 66.6,50.9 66.6,50.19 65.89,49.48 65.28,49.53 63.04,51.61 63.04,52.63
  pour Top (no thermals): 69.09,39.73 69.34,39.73 69.8,39.52 70.41,39.52 70.66,39.27 71.42,38.4 71.12,36.88 69.29,36.98 68.88,37.39 68.53,37.85 68.17,38.2 68.07,38.51 67.92,38.66 65.99,38.66 65.33,39.32 65.33,39.93 65.79,40.39 67.97,40.39
  pour Route15: 58.67,49.53 58.67,50.34 59.44,51.1 59.44,51.56 58.62,52.37 57.56,52.37 57.2,52.02 56.34,52.02 54.05,49.73 54.05,46.84 55.32,45.57 56.85,45.57 58.72,47.45 58.72,49.48
  pour Top (no thermals): 53.14,49.02 55.42,49.02 55.93,48.51 55.93,45.67 55.42,45.16 49.38,45.16 48.56,45.97 48.56,48.62 48.97,49.02
  pour Top (rank 2, no thermals): 58.98,53.54 58.47,53.54 58.42,53.49 58.37,53.44 58.37,51.92 58.27,51.82 57.86,51.41 57.86,50.8 58.01,50.65 58.83,50.65 59.03,50.85 59.03,53.49
A
  Top 0.203: J1.4 38.15,17.59 38.15,18.64 38.91,19.41 40.08,19.41 40.54,19.86 40.54,24.33 40.36,24.51 U1.6 37.52,24.51 36.52,25.5 35.55,25.5 R4.2 35.06,25.46 33.93,24.33 33.93,23.74 R2.1
AOUT1
  pour Top (no thermals): 59.03,53.14 59.03,53.64 59.13,53.75 59.49,53.75 59.64,53.59 59.64,50.19 59.44,49.99 59.44,45.97 60.76,44.65 66.09,44.65 66.9,45.47 67.67,45.52 68.17,44.96 68.12,43.84 67.56,43.33 66.9,43.33 66.65,43.43 66.09,43.38 60.1,43.38 58.01,45.47 58.01,50.14 58.47,50.6 58.67,50.6 59.08,51 59.08,53.09
AOUT2
  Top 0.203: U3.7 60.63,50.73
  pour Top (rank 3, no thermals): 60.3,53.19 60.3,53.54 60.45,53.7 60.81,53.7 60.91,53.59 60.91,50.55 60.25,49.89 60.25,48.56 62.48,45.82 64.47,45.87 65.07,46.63 65.74,46.74 66.34,46.38 66.29,45.26 65.89,44.86 60.76,44.7 59.44,46.02 59.44,49.99 59.84,50.39 60.2,50.39 60.5,50.7 60.5,51.05 60.2,51.36 60.2,53.09
B
  Top 0.203: J1.5 35.83,21.76 R3.1 35.6,23.67 R2.2 36.22,23.72 36.68,23.27 38.78,23.27 U1.7
BOUT1
  Top 0.203: U3.10 62.59,50.6 63.8,49.38 63.8,47.27 J3.3
  pour Top (rank 2, no thermals): 62.28,52.17 62.28,53.49 62.43,53.64 62.74,53.64 62.89,53.49 62.89,51.61 64.97,49.53 64.97,46.69 64.36,46.08 62.64,46.18 62.53,46.74 62.74,47.19 63.04,47.55 63.3,48.41 63.3,49.48 62.23,50.55 62.23,50.85 62.43,51.05 62.43,51.56 62.23,51.77 62.23,52.12
BOUT2
  Top 0.203: U3.8 61.28,49.21 J3.4
  pour Top (no thermals): 61.01,50.65 61.01,53.54 61.16,53.7 61.37,53.7 61.52,53.54 61.52,51.1 61.93,50.7 61.98,50.7 63.09,49.58 63.14,47.96 62.48,47.29 61.98,47.24 61.32,47.5 60.25,48.56 60.25,49.89
CTRL  (via drill 0.3, 0.5)
  Top 0.203: U2.11 41.13,55.74 v41.96,54.91 | U8.4 13.91,45.81 v13.41,45.31 | v19.79,48.03 24.28,52.53 26.52,52.53 26.92,52.93 29.87,52.93 30.43,53.49 30.43,54.36 30.79,54.71 31.09,54.71 31.55,54.25 32.46,54.25 32.77,53.95 33.93,53.95 35.2,52.68 v35.2,52.22
  Bottom 0.203: v41.96,54.91 41.96,54.71 40.39,53.14 38.51,53.14 37.24,51.87 35.56,51.87 v35.2,52.22 | v13.41,45.31 14.43,45.31 17.14,48.03 v19.79,48.03
DI  (via drill 0.3)
  Top 0.203: U1.4 42.34,25.78 40.89,27.23 40.89,35.51 v41.05,35.66 | v30.58,48.06 30.58,51.31 31.7,52.43 v33.43,52.43 | v32.72,63.3 32.72,63.16 U2.31 | v53.85,50.34 53.85,49.99 53.39,49.53 48.56,49.53 47.6,48.56 47.6,39.83 48.72,38.71 48.72,37.19 v47.19,35.66 | J4.5 61.01,64.57 59.74,64.57 58.88,63.7 58.47,63.7 v55.47,60.71
  Route15 0.203: v32.72,63.3 32.61,63.2 32.61,57.1 33.17,56.54 33.17,55.83 v33.43,55.58
  Bottom 0.203: v30.58,48.06 31.14,47.5 31.14,42.11 32.36,40.89 34.85,40.89 35,40.74 35,38.61 36.17,37.44 38.2,37.44 39.98,35.66 v41.05,35.66 v47.19,35.66 | v33.43,52.43 v33.43,55.58 | v55.47,60.71 55.47,59.28 53.85,57.66 v53.85,50.34
DIR  (via drill 0.3)
  Top 0.203: U3.20 61.94,59.09 v62.48,59.64 | v38.76,67.41 37.73,66.38 U2.25
  Route15 0.203: v47.5,65.23 44.45,65.23 42.27,67.41 v38.76,67.41
  Bottom 0.203: v47.5,65.23 47.85,65.23 48.67,66.04 53.24,66.04 57.71,61.57 62.03,61.57 62.48,61.11 v62.48,59.64
DTR1  (via drill 0.3)
  Top 0.203: U1.2 45.24,23.24 45.52,23.52 45.52,24.33 45.36,24.49 45.36,24.99 | v41.1,36.78 45.57,32.31 45.57,25.2 45.36,24.99 | v31.14,48.97 31.14,51 31.9,51.77 32.72,51.77 v32.77,51.82 | v33.33,57.25 33.44,57.25 U2.2 | U1.3 44.88,24.51 45.36,24.99
  Bottom 0.203: v41.1,36.78 39.83,36.78 38.51,38.1 36.37,38.1 35.66,38.81 35.66,41.3 35.51,41.45 32.66,41.45 31.7,42.42 31.7,47.8 31.14,48.36 v31.14,48.97 | v32.77,51.82 32.77,56.69 v33.33,57.25
EE_N
  Top 0.152: J1.8 29.83,19.75 28.63,20.95 25.83,20.95 24.97,20.09 20.25,20.09 R10.1 19.83,20.52 R13.1
EE_P
  Top 0.152: J1.7 31.83,18.26 28.78,21.31 25.68,21.31 24.82,20.45 22.77,20.45 R9.1 21.48,21.74 R11.1
GATE1  (via drill 0.3)
  Top 0.203: v47.4,54.61 46.33,54.61 44.76,53.03 40.69,53.03 40.64,53.09 39.98,53.09 39.42,52.53 39.42,52.27 38.2,51.05 34.7,51.05 33.98,51.77 33.98,52.68 33.68,52.98 31.65,52.98 v31.6,53.03 | v31.6,57.96 33.02,57.96 U2.1 | U4.1 57.01,41.39 v56.9,41.5
  Bottom 0.203: v31.6,53.03 v31.6,57.96 | v47.4,54.61 47.65,54.61 49.43,52.83 49.43,38.41 50.49,37.34 54.71,37.34 55.47,38.1 55.47,40.08 v56.9,41.5
GATE2  (via drill 0.3)
  Top 0.203: v46.18,55.17 44.45,53.44 41.3,53.44 U2.9 | U5.1 56.51,39.81 v56.29,40.03
  Bottom 0.203: v46.18,55.17 46.18,54.61 46.89,53.9 47.5,53.9 48.97,52.43 48.97,38.15 50.24,36.88 55.58,36.88 56.29,37.59 v56.29,40.03
GATE3  (via drill 0.3)
  Top 0.203: v44.96,55.17 44.96,54.97 43.89,53.9 42.06,53.9 40.72,55.25 U2.10 | U6.1 60.84,36.32 v59.03,36.32
  Bottom 0.203: v44.96,55.17 47.24,52.88 47.65,52.88 48.36,52.17 48.36,38 50.29,36.07 54.81,36.07 55.17,36.42 58.93,36.42 v59.03,36.32
GATE4  (via drill 0.3)
  Top 0.203: v43.54,55.88 43.39,55.88 U2.13 | U7.1 60.71,33.58 v60.71,33.68
  Bottom 0.203: v43.54,55.88 43.54,55.68 46.89,52.32 47.3,52.32 47.85,51.77 47.85,37.69 50.24,35.31 54.71,35.31 55.27,35.87 58.27,35.87 58.57,35.56 59.44,35.56 60.71,34.29 v60.71,33.68
GND  (via drill 0.3, 0.5)
  Top 0.203: v39.78,18.85 39.83,18.79 J1.3 | 35.67,27.06 R4.1 35.7,26.87 v36.52,26.87 37.71,26.87 U1.5 | C3.1 79.57,51.34 v78.64,52.27 | v75.23,49.23 73.3,49.23 71.95,47.88 R1.1 71.84,47.64 R6.1 | U3.14 65.69,52.22 v65.89,52.22 | U3.28 56.54,58.52 55.88,58.52 v55.63,58.27 55.63,57.07 R5.1 55.32,56.76 | C8.1 35.17,41.01 v34.34,40.18 | C7.1 45.58,41.01 v45.77,41.2 | C5.1 24.96,57.03 v25.09,56.9 | v16.92,59.54 16.92,59.37 C4.1 | U9.3 33.5,67.48 v33.53,67.51 | U2.20 43.28,63.7 v43.28,63.75 42.88,64.16 42.61,64.16 U2.21 | U2.5 34.94,55.35 v34.94,55.34 | v33.83,56.59 34.75,57.51 U2.3 | v55.78,17.17 54.1,17.17 X1.3 | J5.1 24.38,50.28 v24.38,51.77 | C15.1 36.98,67.04 v36.98,66.19 | C14.1 46.89,25.3 v46.74,25.45 | 51.71,40.39 v51.77,40.34 | C16.1 29.68,66.33 v29.06,66.95 | v16.51,53.14 16.55,53.1 R20.1 18.83,53.1 19.3,52.63 U10.2 20.47,52.63 21.42,53.58 U10.6 | C13.1 49.31,66.33 J4.1
  Top 0.406: C17.NEG 51.77,42.73
  Top 0.5: v60.91,29.72 61.13,29.94 U7.2 | U4.2 58.61,39.69 v58.12,40.18 | U6.2 61.61,34.56 v62.33,33.83 | U5.2 54.75,37.35 v51.77,40.34 | v60.66,55.58 60.91,55.58 U3.TAB | R16.1 19.09,44.21 v19.05,44.25 | R17.1 14.31,51.12
  Top 0.508: 51.77,42.73 v51.77,40.34
  Top 0.635: U8.2 v15.19,49.17
  Top 0.762: C12.1 18.19,48.46 17.48,49.17 v15.19,49.17 15.19,50.24 14.31,51.12
  Bottom 0.203: v55.78,17.17 58.94,20.33 C11.1 58.94,22.71 C10.1 58.74,22.91 C9.1 58.47,25.52
  Bottom 0.5: U11.2 61.59,33.16 61.65,33.16 v62.33,33.83
  other vias: 58.78,56.74 60.71,56.74 61.67,56.74 63.14,56.69 63.09,55.73 62.59,54.76 61.72,55.22 60.76,54.41 58.78,54.41 58.78,55.63 12.75,29.82 13.56,29.82 14.27,29.82
  pour Route2 (no thermals): 12.5,71.58 -0.05,49.94 10.11,23.42 28.8,-0.05 53.9,-0.05 71.83,22.71 82.65,49.83 70.15,71.58 41.3,75.95
  pour Top (no thermals): 12.09,30.07 12.09,29.72 12.65,29.16 14.33,29.16 14.83,29.67 14.83,30.07 14.83,33.83 14.07,34.59 12.8,34.59 12.04,33.83 12.04,30.12
LED_ANODE
  Top 0.5: J7.1 7.29,48.75
  Top 0.762: 7.29,48.75 D1.NEG
LED_CATHODE  (via drill 0.3)
  Top 0.152: R18.2 16.47,51.65 v16,52.12 | v13.06,51.77 R17.2
  Top 0.762: R17.2 9.13,51.77 J7.2
  Bottom 0.152: v16,52.12 13.41,52.12 v13.06,51.77
LED_FB  (via drill 0.3)
  Top 0.152: U8.3 14.24,49.9 v14.28,49.94
  Top 0.173: R18.1 18.07,50.84 v17.27,50.04
  Top 0.203: R19.2 18.25,55.92 v19.1,55.07
  Bottom 0.173: 19.1,51.82 19.05,51.82 v17.27,50.04 17.17,49.94 v14.28,49.94
  Bottom 0.203: v19.1,55.07 19.1,51.82
LED_OV
  Top 0.152: 15.19,45.72 15.89,45.02 R15.1
  Top 0.203: U8.5 15.19,45.72
  Top 0.5: R15.1 R16.2
LED_SW
  Top 0.5: 12.51,44.3 D1.POS | 14.29,44.26 14.33,44.3
  Top 0.635: U8.1 16.14,47.58
  Top 0.762: 16.14,47.58 15.75,47.19 13.77,47.19 11.97,45.4 D1.POS | L1.2 14.33,44.3 12.51,44.3 | R15.2 14.29,44.26
MISO  (via drill 0.3)
  Top 0.203: v47.04,66.55 47.04,66.5 45.77,65.23 v45.77,62.89 | U2.16 44.67,59.28 v44.86,59.28
  Bottom 0.203: J2.1 46.05,67.54 v47.04,66.55 | v44.86,59.28 45.77,60.2 v45.77,62.89
MOSI  (via drill 0.3)
  Top 0.203: v47.75,66.19 47.55,66.19 46.74,65.38 v46.74,62.79 | U2.15 44.38,57.15 44.81,57.15 45.72,58.06 v45.72,58.57
  Bottom 0.203: J2.4 44.76,71.82 45.87,70.71 47.5,70 47.8,69.7 47.8,66.75 47.75,66.7 v47.75,66.19 | v45.72,58.57 46.74,59.59 v46.74,62.79
N$1
  Top 0.203: LED1.A 50.94,60.12 R21.1
N$2
  Top 0.203: LED2.A R14.1 | R14.1
N$3
  Top 0.203: U2.12 41.82,56.38 43.13,55.07 43.79,55.07 44.7,55.98 46.74,55.98 48.62,57.86 LED1.C
N$4
  Top 0.203: U2.14 42.89,57.49 43.89,56.49 45.01,56.49 47.46,58.94 LED2.C
N$5  (via drill 0.3)
  Top 0.203: v55.93,52.68 56.69,52.68 U3.1
  Bottom 0.203: C1.2 55.61,53 v55.93,52.68
N$6  (via drill 0.3)
  Top 0.203: U3.2 57.38,51.8 57.1,51.51 56.54,51.51 56.29,51.26 v56.29,50.9
  Bottom 0.203: C1.1 55.66,50.9 v56.29,50.9
N$7  (via drill 0.3)
  Top 0.203: U3.3 58.03,51.79 57.3,51.05 v57.3,50.95
  Bottom 0.203: C2.2 56.13,49.89 56.79,50.55 56.79,50.65 57.1,50.95 v57.3,50.95
N$8  (via drill 0.3)
  Top 0.203: v59.99,50.8 59.99,52.72 U3.6 | R5.2 52.7,55.61 53.09,55.22 56.74,55.22 v57.54,54.43
  Bottom 0.203: v57.54,54.43 58.22,53.75 59.69,53.75 59.99,53.44 v59.99,50.8
N$9  (via drill 0.3)
  Top 0.203: U3.9 61.94,51.3 v61.98,51.26 | R6.2 67,48.42 v67.46,47.95
  Bottom 0.203: v61.98,51.26 61.98,51.36 62.23,51.61 63.8,51.61 v67.46,47.95
N$10
  Top 0.203: R20.2 18.35,54.7 19.47,53.58 U10.1 19.85,53.64 R19.1
N$11
  Top 0.203: R22.1 | R22.1 LED3.A
N$12  (via drill 0.3)
  Top 0.5: J6.7 64.61,27.55 v63.96,28.19
  Bottom 0.5: v63.96,28.19 63.96,30.92 U11.3
N$13
  Top 0.203: R7.1 78.12,48.97 C3.2 77.05,51.97 71.78,51.97 68.02,55.73 68.02,58.67 65.79,60.91 65.33,60.91 | 65.33,60.91 59.89,60.91 59.34,60.35 59.34,59.94 | 59.34,59.94 U3.24 | U3.25 58.69,59.3 58.78,59.38 | 58.78,59.38 | 58.78,59.38 59.05,59.66 | 59.05,59.66 59.34,59.94 | U3.26 58.03,59.36 58.37,59.69 59.03,59.69 59.05,59.66 | U3.15 65.19,60.77 65.33,60.91
N$14
  Top 0.203: R1.3 75.07,47.53 R7.2
N$15
  Top 0.203: R1.2 67.89,50.78 67.06,51.61 64.31,51.61 | 64.31,51.61 64.16,51.61 63.88,51.89 U3.12 | U3.13 64.53,51.84 64.31,51.61
N$16
  Top 0.203: C6.1 53.75,58.74 53.75,59.59 54.1,59.94 56.69,59.94 59.89,63.14 61.87,63.14 62.42,63.7 J4.6
PUMP  (via drill 0.3)
  Top 0.203: v33.38,59.94 33.38,60.58 U2.32
  Bottom 0.203: v33.38,59.94 33.58,59.74 34.85,59.74 37.59,57 41.2,57 46.48,51.71 46.79,51.71 47.24,51.26 47.24,37.24 48.82,35.66 48.82,31.8 50.19,30.43 52.43,30.43 54.91,27.94 60.81,27.94 61.87,29.01 61.87,30.41 U11.1
RESET  (via drill 0.3)
  Top 0.203: J2.5 38.59,71.3 | 38.59,71.3 R12.1 | 38.59,71.3 37.62,71.3 v36.27,69.95 | v33.88,64.26 v33.88,64.25 U2.29 | C6.2 52.31,58.56 47.65,53.9 46.33,53.9 44.86,52.43 v40.23,52.43 | v38.71,52.48 38.66,52.48 37.69,51.51 35,51.51 34.54,51.97 34.54,52.73 33.88,53.39 32.72,53.39 32.51,53.59 31.39,53.59 v30.99,54
  Bottom 0.203: v36.27,69.95 36.27,66.65 v33.88,64.26 33.07,64.26 32.77,63.96 31.8,63.96 31.6,63.75 30.43,63.75 29.87,63.2 29.87,58.01 30.89,57 30.89,54.1 v30.99,54 | v40.23,52.43 38.76,52.43 v38.71,52.48
RO  (via drill 0.3)
  Top 0.203: U1.1 42.75,21.97 41.86,22.86 41.86,24.74 41.4,25.2 41.4,26.01 40.39,27.03 v40.39,37.54 | v31.9,48.51 31.9,49.23 31.6,49.58 31.6,50.49 v32.21,51.1 | v33.78,63.3 33.78,63.23 U2.30 | v46.53,36.37 47.8,37.64 47.8,38.41 47.04,39.17 47.04,41.86 46.89,42.01 46.89,49.43 48.16,50.7 v53.14,50.7 | J4.4 55.84,62.79 55.02,62.79 54.25,62.03 v54.25,60.86
  Bottom 0.203: v31.9,48.51 32.16,48.26 32.16,42.57 32.82,41.91 35.81,41.91 36.12,41.6 36.12,38.96 36.47,38.61 38.81,38.61 39.88,37.54 v40.39,37.54 42.11,37.54 43.28,36.37 v46.53,36.37 | v32.21,51.1 32.21,61.72 v33.78,63.3 | v54.25,60.86 54.25,59.08 53.03,57.86 53.03,50.8 v53.14,50.7
SCK  (via drill 0.3)
  Top 0.203: 44.85,61.87 44.86,61.87 45.06,62.08 45.06,65.28 46.08,66.29 v46.08,66.4 | 44.85,61.87 U2.17 | LED3.C 44.85,61.73 44.85,61.87
  Bottom 0.203: J2.3 43.73,68.84 46.08,66.5 v46.08,66.4
SCL  (via drill 0.3)
  Top 0.203: v34.95,64.31 v34.96,64.31 U2.28 | U10.5 23.16,52.63 24.08,53.54 26.16,53.54 26.52,53.9 29.16,53.9 29.36,54.1 29.36,54.56 30.33,55.52 30.33,58.17 31.34,59.18 31.34,64.36 v31.24,64.47
  Route15 0.203: v34.95,64.31 v33.63,65.63 32.46,64.47 v31.24,64.47
SDA  (via drill 0.3)
  Top 0.203: v33.98,66.34 33.88,66.45 32.41,66.45 31.8,65.84 v31.8,65.28 31.8,58.98 30.84,58.01 30.84,55.42 29.92,54.51 29.92,53.85 29.46,53.39 26.77,53.39 26.36,52.98 24.13,52.98 22.82,51.68 U10.4 | v35.61,64.82 35.61,64.79 U2.27
  Route15 0.203: v33.98,66.34 34.09,66.34 v35.61,64.82
SOL1
  Top 0.203: J6.3 66.3,35.5
  Top 0.5: 66.3,35.5 62.64,39.22 62.38,39.47 61.7,40.1 U4.3
SOL2
  Top 0.5: U5.3 62.59,38.2 64.72,36.07 64.72,35.09 J6.4 65.77,34.04
SOL3
  Top 0.5: U6.3 63.25,35.61 63.5,35.41 63.5,34.11 J6.5
SOL4
  Top 0.203: 63.5,31.68 | 65.59,29.82 J6.6
  Top 0.5: U7.3 63.5,31.68 63.5,30.74 64.41,29.82 65.59,29.82
STEP  (via drill 0.3)
  Top 0.203: U3.22 60.63,59.77 v60.71,59.84 | v41.2,66.04 41.1,66.04 U2.24
  Bottom 0.203: v41.2,66.04 41.35,65.89 43.74,65.89 45.31,64.31 46.53,64.31 47.24,63.6 47.85,63.6 49.02,64.77 50.14,64.77 50.39,65.02 52.48,65.02 57.05,60.45 60.1,60.45 v60.71,59.84
USB_N  (via drill 0.3)
  Top 0.152: 24.51,46.13 21.74,46.13 21.51,45.9 21.51,38.99 17.14,34.62 17.14,24.64 17.31,24.47 17.53,24.47 | R11.2 17.53,24.47 | R13.2 18.39,19.46 18.39,20.12 v17.07,21.44 | v17.68,23.77 17.68,24.32 17.53,24.47
  Top 0.203: 24.51,46.13 J5.3
  Bottom 0.152: v17.07,21.44 17.07,23.16 v17.68,23.77
USB_P
  Top 0.152: J5.2 23.25,48.14 21.16,46.05 21.16,39.14 16.79,34.77 16.79,23.8 18.27,22.32 18.27,22.1 | R10.2 18.27,22.1 | R9.2 18.56,22.39 18.27,22.1
VOUT  (via drill 0.3)
  Top 0.203: U2.23 43.45,67.26 47.09,67.26 47.8,67.97 47.8,69.09 50.19,71.48 60.96,66.8 70.21,66.9 71.98,66.45 80.97,51.61 80.97,50.04 79.55,48.62 75.69,46.43 73.1,44.15 73.1,39.42 71.93,38.25 71.93,28.7 70.92,22.96 63.55,17.83 55.98,15.04 | X1.4 52.85,11.9 55.98,15.04 | 55.98,15.04 58.22,17.27 58.22,17.78 57.61,18.39 56.54,18.39 v55.37,19.56
  Bottom 0.203: 57.49,21.12 C11.2 56.48,19.56 v55.37,19.56
XTAL1  (via drill 0.3)
  Top 0.203: 15.95,62.13 15.9,62.08 | 17.24,62.03 Q2.1 17.19,61.45 18.34,60.3 18.34,58.41 C4.2 18.48,58.27 v19.56,58.27 R8.1 | U2.7 37.11,55.25 37.95,56.08 37.95,57.91 v36.68,59.18
  Top 0.5: 15.95,62.13 17.14,62.13 Q2.1
  Route2 0.203: v36.68,59.18 21.89,59.18 21.03,58.32 19.61,58.32 v19.56,58.27
XTAL2  (via drill 0.3)
  Top 0.203: 25.45,62.08 Q2.2 25.59,62.18 | 23.47,58.43 C5.2 23.38,58.27 v22.76,58.27 | 22.81,58.27 v22.76,58.27 | U2.8 37.66,54.78 v38.86,55.98 | v22.76,58.27 R8.2
  Top 0.3: 25.59,62.18 24.13,62.18 22.81,60.86 22.81,58.27
  Route2 0.203: v38.86,55.98 38.86,57.61 37.9,58.57 36.12,58.57 35.92,58.78 25.96,58.73 23.27,58.73 v22.76,58.27

### Text on the board
tPlace: USB CAM | RINGLIGHT | SOLENOIDS | MOD TOOL
bPlace: SPI | FTDI
tDocu: MILL / THIS / AREA | MILL | MILL / THIS / AREA